# EAGLE design logoi (EAGLE 9.0.0)
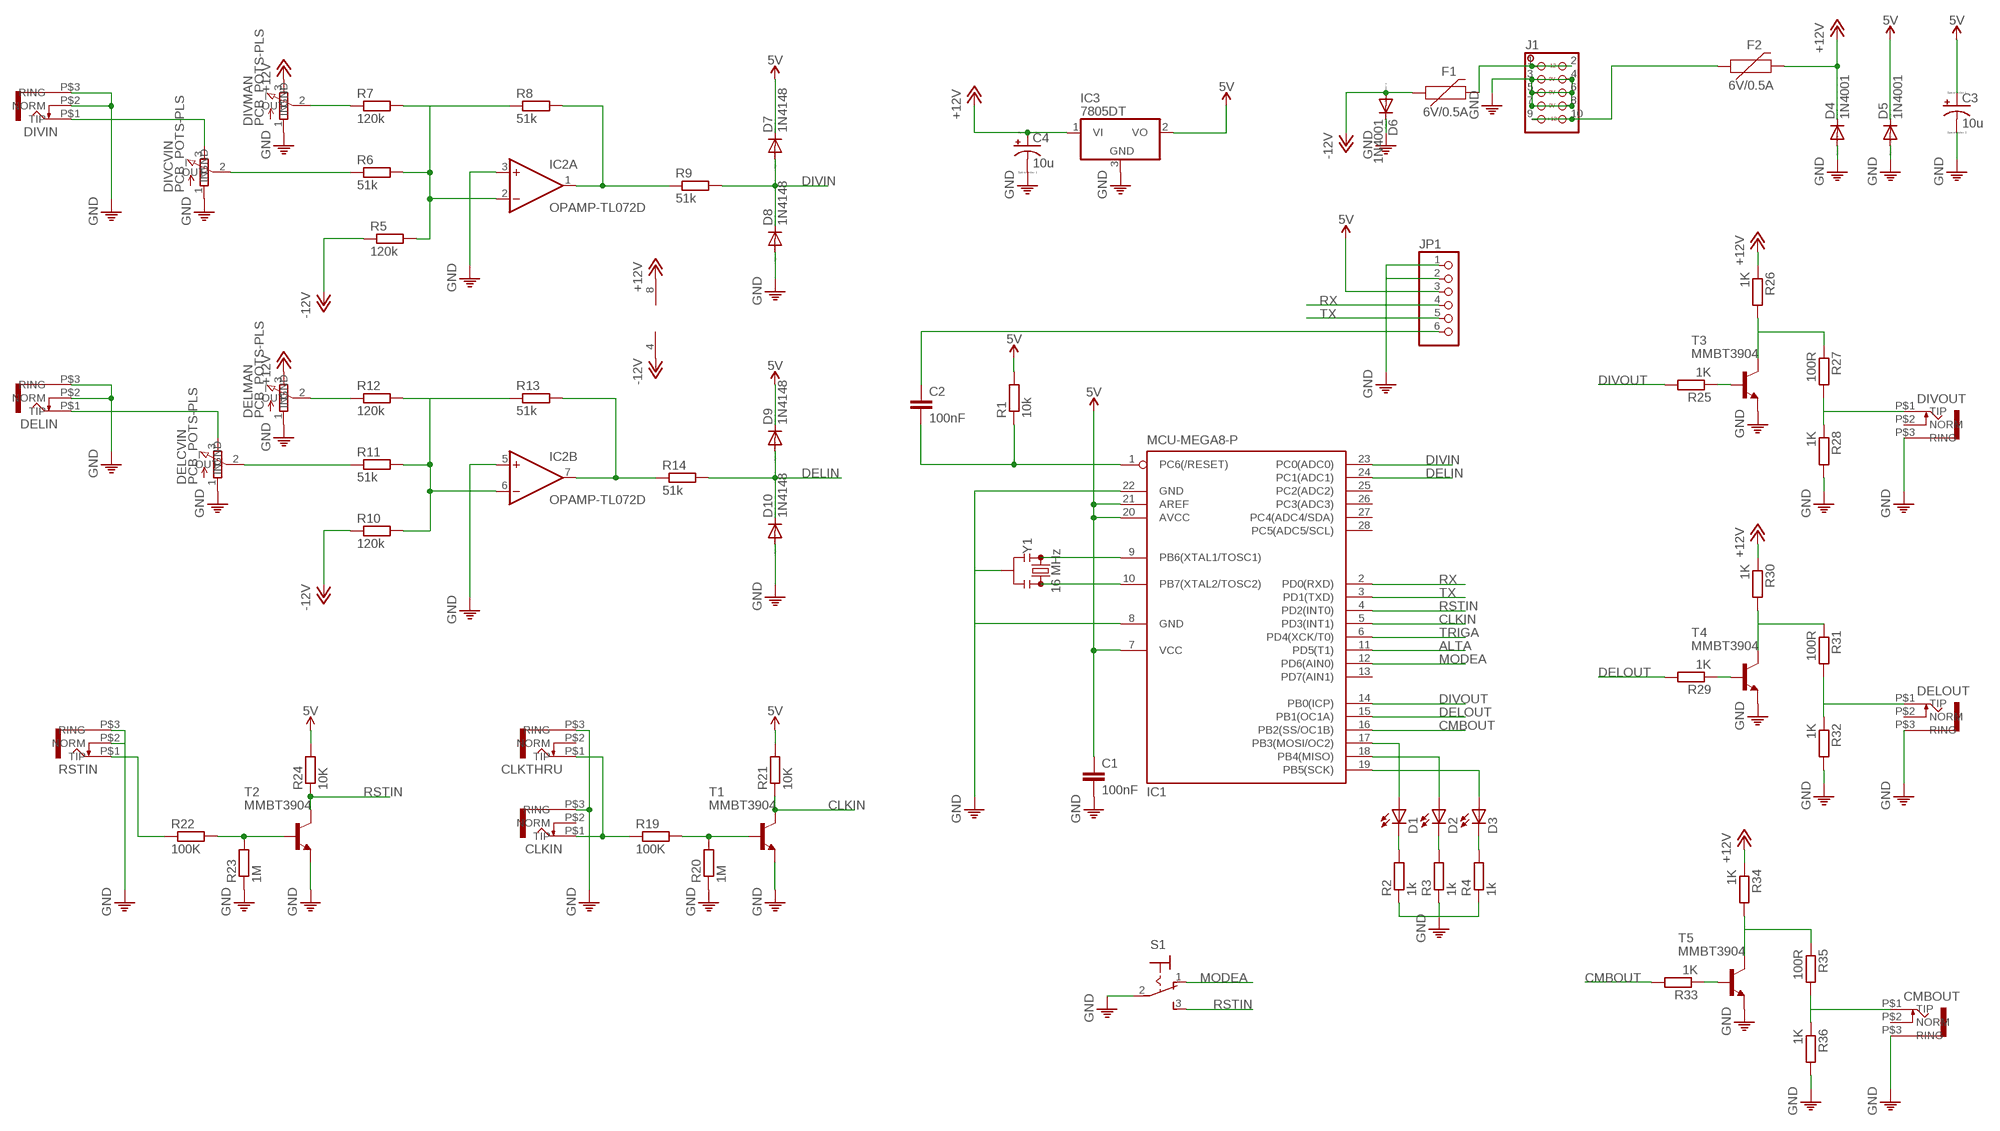
[diagram p0: schematic, sheet 1]

## Parts
C1  100nF  CAPACITOR-EUC0603  [C0603]
C2  100nF  CAPACITOR-EUC0603  [C0603]
C3  10u  CAPACITOR_POLARIZED-USE2.5-5  [E2,5-5]
C4  10u  CAPACITOR_POLARIZED-USE2.5-5  [E2,5-5]
CLKIN  VERTICALJACKS  [KOBICONN_PJM301DM_JACK]
CLKTHRU  VERTICALJACKS  [KOBICONN_PJM301DM_JACK]
CMBOUT  VERTICALJACKS  [KOBICONN_PJM301DM_JACK]
D1  LED3MM  [LED3MM]
D2  LED3MM  [LED3MM]
D3  LED3MM  [LED3MM]
D4  1N4001  DIODE-DO-214AC  [DO-214AC]
D5  1N4001  DIODE-DO-214AC  [DO-214AC]
D6  1N4001  DIODE-DO-214AC  [DO-214AC]
D7  1N4148  DIODE-1N4148SOD-323  [SOD323W_INFINEON]
D8  1N4148  DIODE-1N4148SOD-323  [SOD323W_INFINEON]
D9  1N4148  DIODE-1N4148SOD-323  [SOD323W_INFINEON]
D10  1N4148  DIODE-1N4148SOD-323  [SOD323W_INFINEON]
DELCVIN  PCB_POTS-PLS  [9MM_PLS]
DELIN  VERTICALJACKS  [KOBICONN_PJM301DM_JACK]
DELMAN  PCB_POTS-PLS  [9MM_PLS]
DELOUT  VERTICALJACKS  [KOBICONN_PJM301DM_JACK]
DIVCVIN  PCB_POTS-PLS  [9MM_PLS]
DIVIN  VERTICALJACKS  [KOBICONN_PJM301DM_JACK]
DIVMAN  PCB_POTS-PLS  [9MM_PLS]
DIVOUT  VERTICALJACKS  [KOBICONN_PJM301DM_JACK]
F1  6V/0.5A  FUSE-PPTC_HALF-AMP  [1206]
F2  6V/0.5A  FUSE-PPTC_HALF-AMP  [1206]
IC1  MCU-MEGA8-P  [DIL28-3]
IC2  OPAMP-TL072D  [SO08]
IC3  7805DT  [TO252]
J1  HEADER-EUROPWR_2X05-OPEN  [2X05_EUROPWR_OPEN]
JP1  PINHD-1X6  [1X06]
R1  10k  RESISTOR-EU_R0603  [R0603]
R2  1k  RESISTOR-EU_R0603  [R0603]
R3  1k  RESISTOR-EU_R0603  [R0603]
R4  1k  RESISTOR-EU_R0603  [R0603]
R5  120k  RESISTOR-EU_R0603  [R0603]
R6  51k  RESISTOR-EU_R0603  [R0603]
R7  120k  RESISTOR-EU_R0603  [R0603]
R8  51k  RESISTOR-EU_R0603  [R0603]
R9  51k  RESISTOR-EU_R0603  [R0603]
R10  120k  RESISTOR-EU_R0603  [R0603]
R11  51k  RESISTOR-EU_R0603  [R0603]
R12  120k  RESISTOR-EU_R0603  [R0603]
R13  51k  RESISTOR-EU_R0603  [R0603]
R14  51k  RESISTOR-EU_R0603  [R0603]
R19  100K  RESISTOR-EU_R0603  [R0603]
R20  1M  RESISTOR-EU_R0603  [R0603]
R21  10K  RESISTOR-EU_R0603  [R0603]
R22  100K  RESISTOR-EU_R0603  [R0603]
R23  1M  RESISTOR-EU_R0603  [R0603]
R24  10K  RESISTOR-EU_R0603  [R0603]
R25  1K  RESISTOR-EU_R0603  [R0603]
R26  1K  RESISTOR-EU_R0603  [R0603]
R27  100R  RESISTOR-EU_R0603  [R0603]
R28  1K  RESISTOR-EU_R0603  [R0603]
R29  1K  RESISTOR-EU_R0603  [R0603]
R30  1K  RESISTOR-EU_R0603  [R0603]
R31  100R  RESISTOR-EU_R0603  [R0603]
R32  1K  RESISTOR-EU_R0603  [R0603]
R33  1K  RESISTOR-EU_R0603  [R0603]
R34  1K  RESISTOR-EU_R0603  [R0603]
R35  100R  RESISTOR-EU_R0603  [R0603]
R36  1K  RESISTOR-EU_R0603  [R0603]
RSTIN  VERTICALJACKS  [KOBICONN_PJM301DM_JACK]
S1  SWITCH-SPDT-320-916  [320-916]
T1  MMBT3904  TRANSISTOR-NPN-MMBT3904LT1SOT23-BEC  [SOT23-BEC]
T2  MMBT3904  TRANSISTOR-NPN-MMBT3904LT1SOT23-BEC  [SOT23-BEC]
T3  MMBT3904  TRANSISTOR-NPN-MMBT3904LT1SOT23-BEC  [SOT23-BEC]
T4  MMBT3904  TRANSISTOR-NPN-MMBT3904LT1SOT23-BEC  [SOT23-BEC]
T5  MMBT3904  TRANSISTOR-NPN-MMBT3904LT1SOT23-BEC  [SOT23-BEC]
Y1  16 MHz  RESONATORPTH-7.6X3.8  [RESONATOR-PTH-7.6X3.8]

## Nets
5V: C1.1 C3.+ D5.C D7.C D9.C IC1.7(VCC) IC1.20(AVCC) IC1.21(AREF) IC3.2(VO) JP1.3 R1.2 R21.2 R24.2
+12V: C4.+ D4.C DELMAN.3(IN) DIVMAN.3(IN) F2.2 IC2.8(P:V+) IC3.1(VI) R26.1 R30.1 R34.1
-12V: D6.A F1.1 IC2.4(P:V-) R5.1 R10.1
ALTA: IC1.11(PD5(T1))
CLKIN: IC1.5(PD3(INT1)) R21.1 T1.C
CMBOUT: IC1.16(PB2(SS/OC1B)) R33.2
DELIN: D9.A D10.C IC1.24(PC1(ADC1)) R14.2
DELOUT: IC1.15(PB1(OC1A)) R29.2
DIVIN: D7.A D8.C IC1.23(PC0(ADC0)) R9.2
DIVOUT: IC1.14(PB0(ICP)) R25.2
MODEA: IC1.12(PD6(AIN0)) S1.1(O)
N$1: IC1.9(PB6(XTAL1/TOSC1)) Y1.1
N$2: IC1.10(PB7(XTAL2/TOSC2)) Y1.3
N$3: F1.2 J1.1 J1.2
N$4: C2.2 IC1.1(PC6(/RESET)) R1.1
N$5: C2.1 JP1.6
N$7 [GND]: F2.1 J1.9 J1.10
N$9: IC2.2(A:-IN) R5.2 R6.2 R7.2 R8.1
N$10: IC2.1(A:OUT) R8.2 R9.1
N$12: R25.1 T3.B
N$13: IC2.6(B:-IN) R10.2 R11.2 R12.2 R13.1
N$14: R26.2 R27.1 T3.C
N$15: IC2.7(B:OUT) R13.2 R14.1
N$17: DIVOUT.P$1(TIP) R27.2 R28.1
N$18: DIVCVIN.3(IN) DIVIN.P$1(TIP)
N$19: DIVCVIN.2(OUT) R6.1
N$20: DIVMAN.2(OUT) R7.1
N$21: D1.K(C) R2.2
N$22: D2.K(C) R3.2
N$23: D3.K(C) R4.2
N$24: D1.A IC1.17(PB3(MOSI/OC2))
N$25: D2.A IC1.18(PB4(MISO))
N$26: D3.A IC1.19(PB5(SCK))
N$27: DELCVIN.2(OUT) R11.1
N$28: DELCVIN.3(IN) DELIN.P$1(TIP)
N$29: DELMAN.2(OUT) R12.1
N$30: CLKIN.P$1(TIP) CLKTHRU.P$1(TIP) R19.1
N$31: R19.2 R20.2 T1.B
N$33: R22.1 RSTIN.P$1(TIP)
N$34: R22.2 R23.2 T2.B
N$35: R29.1 T4.B
N$36: R30.2 R31.1 T4.C
N$37: DELOUT.P$1(TIP) R31.2 R32.1
N$39: R33.1 T5.B
N$40: R34.2 R35.1 T5.C
N$41: CMBOUT.P$1(TIP) R35.2 R36.1
PE [GND]: C1.2 C3.- C4.- CLKIN.P$3(RING) CLKTHRU.P$3(RING) CMBOUT.P$3(RING) D4.A D5.A D6.C D8.A D10.A DELCVIN.1(GND) DELIN.P$2(NORM) DELIN.P$3(RING) DELMAN.1(GND) DELOUT.P$3(RING) DIVCVIN.1(GND) DIVIN.P$2(NORM) DIVIN.P$3(RING) DIVMAN.1(GND) DIVOUT.P$3(RING) IC1.8(GND) IC1.22(GND) IC2.3(A:+IN) IC2.5(B:+IN) IC3.3(GND) J1.3 J1.4 J1.5 J1.6 J1.7 J1.8 JP1.1 JP1.2 R2.1 R3.1 R4.1 R20.1 R23.1 R28.2 R32.2 R36.2 RSTIN.P$2(NORM) RSTIN.P$3(RING) S1.2(P) T1.E T2.E T3.E T4.E T5.E Y1.2 ; supply symbol labelled GND
RSTIN: IC1.4(PD2(INT0)) R24.1 S1.3(S) T2.C
RX: IC1.2(PD0(RXD)) JP1.4
TRIGA: IC1.6(PD4(XCK/T0))
TX: IC1.3(PD1(TXD)) JP1.5
Unconnected: CLKIN.P$2(NORM) CLKTHRU.P$2(NORM) CMBOUT.P$2(NORM) DELOUT.P$2(NORM) DIVOUT.P$2(NORM) IC1.13(PD7(AIN1)) IC1.25(PC2(ADC2)) IC1.26(PC3(ADC3)) IC1.27(PC4(ADC4/SDA)) IC1.28(PC5(ADC5/SCL))

## Library data of the parts
C1 C2 = 0000-master:CAPACITOR-EU: CAPACITOR, European symbol
C3 C4 = 0000-master:CAPACITOR_POLARIZED-US: POLARIZED CAPACITOR, American symbol
CLKIN CLKTHRU CMBOUT DELIN DELOUT DIVIN DIVOUT RSTIN = 0000-master:VERTICALJACKS
D1-D3 = 0000-master:LED: LED OSRAM: - CHIPLED LG R971, LG N971, LY N971, LG Q971, LY Q971, LO R971, LY R971 LH N974, LH R974 LS Q976, LO Q976, LY Q976 LO Q996 - Hyper CHIPLED LW Q18S LB Q993, LB Q99A, LB R99A - SideLED LS A670, LO A670, LY A670, LG A670, LP A670 LB A673, LV A673, LT A673, LW A673 LH A674 LY A675 LS A676, LA A676, LO A676, LY A676, LW A676 LS A679, LY A679, LG A679 - Hyper Micro SIDELED® LS Y876, LA Y876, LO Y876, LY Y876 LT Y87S - SmartLED LW L88C, LW L88S LB L89C, LB L89S, LG L890 LS L89K, LO L89K, LY L89K LS L896, LA L896, LO L896, LY L896 - TOPLED LS T670, LO T670, LY T670, LG T670, LP T670 LSG T670, LSP T670, LSY T670, LOP T670, LYG T670 LG T671, LOG T671, LSG T671 LB T673, LV T673, LT T673, LW T673 LH T674 LS T676, LA T676, LO T676, LY T676, LB T676, LH T676, LSB T676, LW T676 LB T67C, LV T67C, LT T67C, LS T67K, LO T67K, LY T67K, LW E67C LS E67B, LA E67B, LO E67B, LY E67B, LB E67C, LV E67C, LT E67C LW T67C LS T679, LY T679, LG T679 LS T770, LO T770, LY T770, LG T770, LP T770 LB T773, LV T773, LT T773, LW T773 LH T774 LS E675, LA E675, LY E675, LS T675 LS T776, LA T776, LO T776, LY T776, LB T776 LHGB T686 LT T68C, LB T68C - Hyper Mini TOPLED® LB M676 - Mini TOPLED Santana® LG M470 LS M47K, LO M47K, LY M47K Source: http://www.osram.convergy.de LUXEON: - LUMILED® LXK2-PW12-R00, LXK2-PW12-S00, LXK2-PW14-U00, LXK2-PW14-V00 LXK2-PM12-R00, LXK2-PM12-S00, LXK2-PM14-U00 LXK2-PE12-Q00, LXK2-PE12-R00, LXK2-PE12-S00, LXK2-PE14-T00, LXK2-PE14-U00 LXK2-PB12-K00, LXK2-PB12-L00, LXK2-PB12-M00, LXK2-PB14-N00, LXK2-PB14-P00, LXK2-PB14-Q00 LXK2-PR12-L00, LXK2-PR12-M00, LXK2-PR14-Q00, LXK2-PR14-R00 LXK2-PD12-Q00, LXK2-PD12-R00, LXK2-PD12-S00 LXK2-PH12-R00, LXK2-PH12-S00 LXK2-PL12-P00, LXK2-PL12-Q00, LXK2-PL12-R00 Source: www.luxeon.com KINGBRIGHT: KA-3528ASYC Source: www.kingbright.com
D4-D6 = diode:DIODE-: DIODE
D7-D10 = 0000-master:DIODE-1N4148: DIODE high speed (Philips)
DELCVIN DELMAN DIVCVIN DIVMAN = 0000-master:PCB_POTS: 9 mm Square Rotary Potentiometers Source: Panasonic
F1 F2 = 0000-master:FUSE-PPTC: Resettable Fuse PPTC Resettable Fuse. Really a sort of resistor with a polymeric positive temperature coefficient whose resistance increases dramatically with an increase in temperature. When heated by the power passing through the resistance rises causing the current to be limited, protecting the circuit. This is achieved by the transition of the polymer from a crystalline to an amorphous state where the conductive carbon separates breaking the conductive pathways found in the cool crystalline structure. When a PPTC cools back down it resumes conducting letting the circuit turn back on. SparkFun Products: SparkFun RedBoard - Programmed with Arduino <https://www.sparkfun.com/products/12757> Pro Micro - 5V/16MHz <https://www.sparkfun.com/products/12640> Arduino Pro 328 - 5V/16MHz <https://www.sparkfun.com/products/10915> MP3 Trigger <https://www.sparkfun.com/products/13720>; PROD_ID: RES-08585
IC1 = 0000-master:MCU-MEGA8-P: MICROCONTROLLER 8 Kbytes FLASH, 1 kbytes SRAM, 512 bytes EEPROM, USART, 4-channel 10 bit ADC, 2-channel 8 bit ADC Pin compatible with Atmega48, ATMega88, ATMega168 Source: avr.lbr; OC_FARNELL: unknown; OC_NEWARK: unknown
IC2 = 0000-master:OPAMP-TL072: OP AMP
IC3 = linear:78*: Positive VOLTAGE REGULATOR Source: http://cache.national.com/ds/LM/LM78L05.pdf http://www.fairchildsemi.com/ds/LM/LM7805.pdf
J1 = 0000-master:HEADER-EUROPWR_2X05: 2x05 pin header
JP1 = pinhead:PINHD-1X6: PIN HEADER
R1-R14 R19-R36 = 0000-master:RESISTOR-EU_: RESISTOR, European symbol
S1 = 0000-master:SWITCH-SPDT-320-916: TOGGLE SWITCH distributor RS Components
T1-T5 = 0000-master:TRANSISTOR-NPN-: NPN Transistror BF959 corrected 2008.03.06
Y1 = 0000-master:RESONATOR: Resonators (Generic) Ceramic resonators are clock-generating components, often used to control timing in microcontrollers. They usually have 3 pins: two pins for oscillation, and one pin for ground. Compared to crystals, resonators have worse tolerance, but are usually much cheaper. Plus, they have built-in load capacitors! These devices are used on boards like the Arduino Pro 8MHz <https://www.sparkfun.com/products/11114> and Arduino Pro 16MHz <https://www.sparkfun.com/products/11113>.

## Net classes
0 default: width 0.203 mm
1 GND: width 0.305 mm

## Board
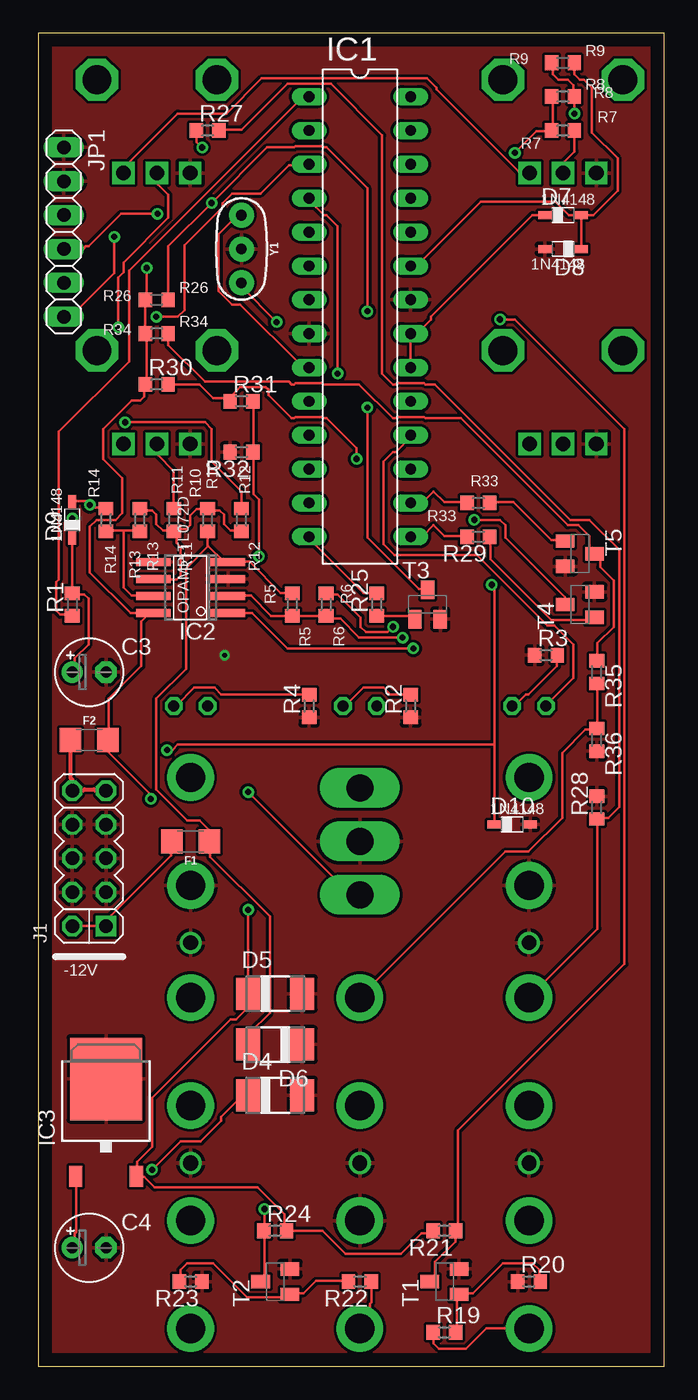
[diagram p1: board, top side]
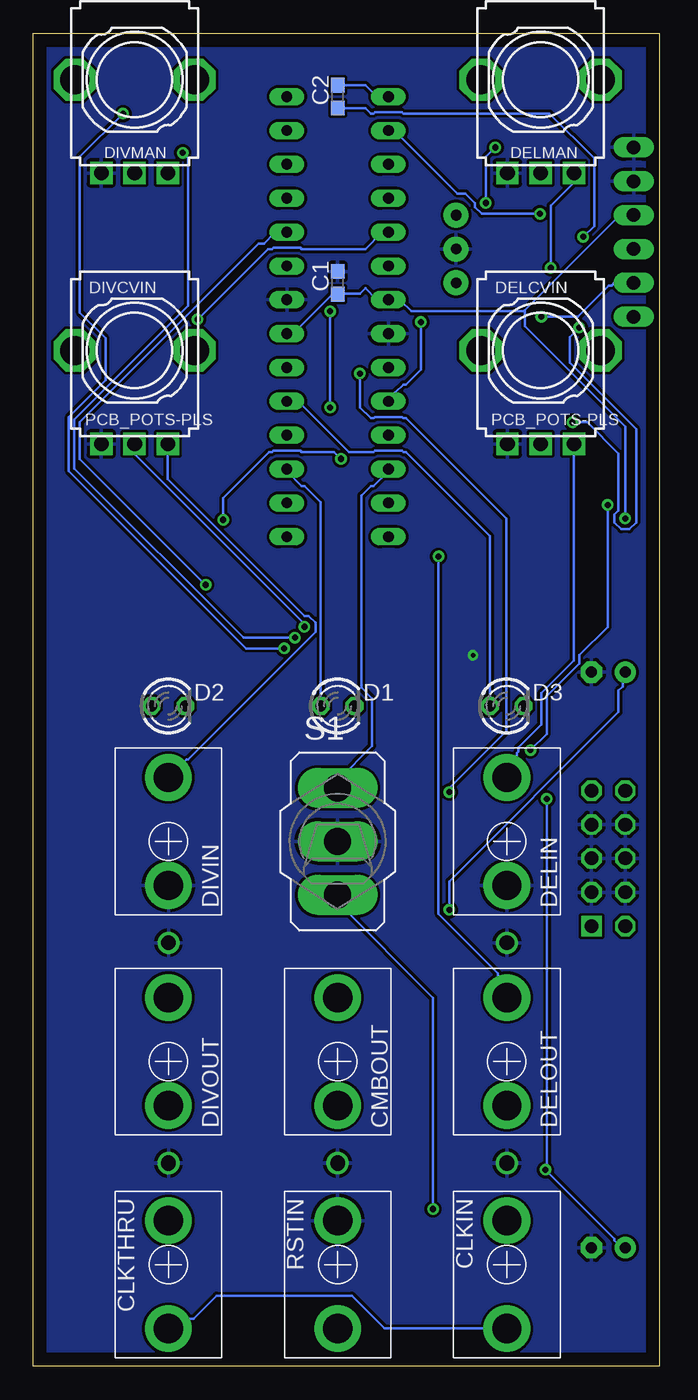
[diagram p2: board, bottom side, seen from below]

Size 46.97 x 100 mm. Coordinates in mm from the lower left corner, seen from the top.
Outline: 0,0 46.97,0 46.97,100 0,100 0,0
Copper layers (1*16): Top 0.035mm / dielectric 1.5mm / Bottom 0.035mm
Design rules "default *": minimum track width 8mil, minimum drill 18mil, track to track 8mil, track to pad 8mil, pad to pad 8mil, via to via 8mil, smd to smd 8mil, copper to edge 40mil, drill to drill 8mil, minimum pad ring 10mil, minimum via ring 8mil, stop-mask expansion 4mil, vias tented up to drill 0mil, thermal gap 10mil

### Footprints (pad centres in the part's own frame; a part is rotated, then mirrored left to right if it is on the bottom)
C0603 = smd 1.1 x 1: 1 -0.85,0; 2 0.85,0
E2,5-5 = drill 0.813 pad 1.6: + -1.27,0 | drill 0.813 pad 1.6 octagon: - 1.27,0
KOBICONN_PJM301DM_JACK = drill 2.2 pad 3.5: P$1 0,4.8; P$2 0,-3.3 | drill 1.1: P$3 0,-7.6
LED3MM = drill 0.813 octagon: A -1.27,0; K 1.27,0
DO-214AC = smd 1.8 x 2.4: A 2.025,0; C -2.025,0
SOD323W_INFINEON = smd 1 x 0.6: A 1.35,0; C -1.35,0
9MM_PLS = drill 1.1 pad 1.676 square: 1 -2.5,-7; 2 0,-7; 3 2.5,-7 | drill 2.159 pad 3.175 octagon: M1 4.5,0; M2 -4.5,0
1206 = smd 1.6 x 1.8: 1 -1.4,0; 2 1.4,0
DIL28-3 = drill 0.813 long: 1 -16.51,-3.81; 2 -13.97,-3.81; 3 -11.43,-3.81; 4 -8.89,-3.81; 5 -6.35,-3.81; 6 -3.81,-3.81; 7 -1.27,-3.81; 8 1.27,-3.81; 9 3.81,-3.81; 10 6.35,-3.81; 11 8.89,-3.81; 12 11.43,-3.81; 13 13.97,-3.81; 14 16.51,-3.81; 15 16.51,3.81; 16 13.97,3.81; 17 11.43,3.81; 18 8.89,3.81; 19 6.35,3.81; 20 3.81,3.81; 21 1.27,3.81; 22 -1.27,3.81; 23 -3.81,3.81; 24 -6.35,3.81; 25 -8.89,3.81; 26 -11.43,3.81; 27 -13.97,3.81; 28 -16.51,3.81
SO08 = smd 0.6 x 2.6: 1 -1.905,-2.8; 2 -0.635,-2.8; 3 0.635,-2.8; 4 1.905,-2.8; 5 1.905,2.8; 6 0.635,2.8; 7 -0.635,2.8; 8 -1.905,2.8
TO252 = smd 1 x 1.6: 1 -2.28,-4.8; 2 2.28,-4.8 | smd 5.4 x 6.2: 3 0,2.5
2X05_EUROPWR_OPEN = drill 1.016 square: 1 -5.08,-1.27 | drill 1.016 octagon: 2 -5.08,1.27; 3 -2.54,-1.27; 4 -2.54,1.27; 5 0,-1.27; 6 0,1.27; 7 2.54,-1.27; 8 2.54,1.27; 9 5.08,-1.27; 10 5.08,1.27
1X06 = drill 1.016 long: 1 -6.35,0; 2 -3.81,0; 3 -1.27,0; 4 1.27,0; 5 3.81,0; 6 6.35,0
R0603 = smd 1 x 1.1: 1 -0.85,0; 2 0.85,0
320-916 = drill 2.007 long: 1 0,4.013; 2 0,0; 3 0,-4.013
SOT23-BEC = smd 1 x 1.4: B -0.95,-1.1; C 0,1.1; E 0.95,-1.1
RESONATOR-PTH-7.6X3.8 = drill 0.8 pad 1.88: 1 -2.54,0; 2 0,0; 3 2.54,0

### Placement (x,y rotation side)
C1  24.13,81.28 90 bottom
C2  24.13,95.25 90 bottom
C3  3.81,52.07 0 top
C4  3.81,8.89 0 top
CLKIN  11.43,7.62 180 bottom
CLKTHRU  36.83,7.62 180 bottom
CMBOUT  24.13,22.86 0 bottom
D1  24.13,49.53 0 bottom
D2  36.83,49.53 0 bottom
D3  11.43,49.53 0 bottom
D4  17.78,20.32 0 top
D5  17.78,27.94 0 top
D6  17.78,24.13 180 top
D7  39.37,86.36 0 top
D8  39.37,83.82 180 top
D9  2.54,63.5 90 top
D10  35.56,40.64 0 top
DELCVIN  8.89,76.2 0 bottom
DELIN  11.43,39.37 0 bottom
DELMAN  8.89,96.52 0 bottom
DELOUT  11.43,22.86 0 bottom
DIVCVIN  39.37,76.2 0 bottom
DIVIN  36.83,39.37 0 bottom
DIVMAN  39.37,96.52 0 bottom
DIVOUT  36.83,22.86 0 bottom
F1  11.43,39.37 180 top
F2  3.81,46.99 0 top
IC1  24.13,78.74 270 top
IC2  11.43,58.42 90 top
IC3  5.08,19.05 0 top
J1  3.81,38.1 90 top
JP1  1.91,85.09 270 top
R1  2.54,57.15 90 top
R2  27.94,49.53 90 top
R3  38.1,53.34 0 top
R4  20.32,49.53 90 top
R5  19.05,57.15 270 top
R6  21.59,57.15 270 top
R7  39.37,92.71 180 top
R8  39.37,95.25 0 top
R9  39.37,97.79 0 top
R10  12.7,63.5 90 top
R11  10.16,63.5 270 top
R12  15.24,63.5 270 top
R13  7.62,63.5 270 top
R14  5.08,63.5 90 top
R19  30.48,2.54 0 top
R20  36.83,6.35 0 top
R21  30.48,10.16 180 top
R22  24.13,6.35 180 top
R23  11.43,6.35 180 top
R24  17.78,10.16 0 top
R25  25.4,57.15 90 top
R26  8.89,80.01 0 top
R27  12.7,92.71 0 top
R28  41.91,41.91 90 top
R29  33.02,62.23 180 top
R30  8.89,73.66 0 top
R31  15.24,72.39 0 top
R32  15.24,68.58 180 top
R33  33.02,64.77 180 top
R34  8.89,77.47 0 top
R35  41.91,52.07 270 top
R36  41.91,46.99 270 top
RSTIN  24.13,7.62 180 bottom
S1  24.13,39.37 0 bottom
T1  30.48,6.35 90 top
T2  17.78,6.35 90 top
T3  29.21,57.15 0 top
T4  40.64,57.15 90 top
T5  40.64,60.96 270 top
Y1  15.24,83.82 270 top

### Tracks (layer width: path | path; a pad name or v marks a point on that pad's centre or on a via)
5V  (via drill 0.46)
  Top 0.203: R21.2 29.57,10.16 29.36,9.96 28.75,9.96 27.23,8.43 23.06,8.43 21.34,10.16 R24.2 18.59,10.16 18.49,10.26 18.49,11.38 16.46,13.41 8.74,13.41 7.92,14.22 7.42,14.22 IC3.2 7.42,14.33 7.42,15.34 8.53,16.46 8.53,20.12 14.43,26.01 14.83,26.01 15.75,26.92 15.75,27.94 | D7.C 37.08,86.36 29.46,78.74 29.46,78.54 28.45,77.52 27.94,77.52 IC1.21 IC1.20 | C3.+ 2.54,52.12 2.74,52.32 2.74,53.14 3.76,54.15 3.76,57.61 3.45,57.91 2.54,57.91 R1.2 D9.C v2.54,63.6 | v15.75,34.24 15.75,27.94 | 15.75,27.94 D5.C
  Bottom 0.203: JP1.3 2.95,86.36 10.11,79.2 | 10.11,79.2 10.16,79.15 18.59,79.15 19.41,79.96 20.32,79.96 IC1.7 20.32,80.06 21.23,80.06 22.05,80.87 22.45,80.47 24.08,80.47 C1.1 24.18,80.37 24.59,80.37 27.43,77.52 27.94,77.52 IC1.21 | v2.54,63.6 2.54,70.51 10.06,78.03 10.06,79.15 10.11,79.2 | v15.75,34.24 15.75,36.37 3.05,49.07 3.05,50.7 2.74,51 2.74,51.82 2.54,52.02 C3.+
+12V  (via drill 0.46)
  Top 0.203: IC3.1 2.85,14.22 2.85,10.06 2.74,9.96 2.74,9.14 2.54,8.94 C4.+ | D4.C 15.34,20.32 13.72,18.69 13.72,18.39 12.19,16.87 10.67,16.87 v8.53,14.73 | v8.13,82.4 8.13,80.06 R26.1 8.03,79.96 8.03,77.52 R34.1 8.13,77.42 8.13,73.66 R30.1 8.03,73.66 7.92,73.56 7.92,72.75 7.62,72.44 7.01,72.44 4.88,70.31 4.88,68.07 6.3,66.65 6.3,64.01 5.79,63.5 4.37,63.5 3.86,62.99 3.86,59.54 6.91,56.49 7.82,56.49 8.03,56.29 IC2.8 8.53,56.49 8.33,56.49 7.72,55.88 7.72,52.53 5.28,50.09 5.28,47.04 F2.2 5.18,46.94 5.18,46.13 8.43,42.88 v8.43,42.57 | DIVMAN.3 36.78,89.61 36.07,89.61 29.87,95.81 29.87,95.91 29.16,96.62 16.76,96.62 14.12,93.98 10.46,93.98 6.4,89.92 6.4,89.61 DELMAN.3
  Bottom 0.203: C4.+ 2.54,8.94 2.85,8.94 3.35,9.45 3.35,9.55 v8.53,14.73 8.43,14.73 v8.43,42.57 | v8.13,82.4 8.13,87.07 6.4,88.8 DELMAN.3
-12V
  Top 0.203: R5.1 19,58.01 18.19,58.01 15.85,60.35 14.33,60.35 IC2.4 14.22,60.35 13.92,60.35 12.75,61.52 | R10.1 12.7,61.57 12.75,61.52 | D6.A 15.85,24.18 15.85,24.99 17.37,26.52 17.37,33.73 12.9,38.2 12.9,39.32 F1.1 12.8,39.42 12.8,40.23 12.09,40.95 11.18,40.95 8.84,43.28 8.84,50.09 11.07,52.32 11.07,59.84 12.75,61.52
CLKIN  (via drill 0.46)
  Top 0.203: T1.C 29.46,6.4 29.77,6.71 29.77,7.82 31.29,9.35 31.29,10.16 R21.1 31.39,10.16 31.5,10.26 31.5,17.68 43.99,30.18 43.99,70.31 35.76,78.54 v34.65,78.54
  Bottom 0.203: v34.65,78.54 29.36,83.82 29.06,83.82 28.96,83.92 26.92,83.92 26.82,83.82 22.05,83.82 20.83,85.04 20.32,85.04 IC1.5
CMBOUT
  Top 0.203: R33.2 32.11,64.82 30.48,64.82 29.67,65.63 28.85,64.82 27.94,64.82 IC1.16
DELIN  (via drill 0.46)
  Top 0.203: 3.91,64.67 4.17,64.41 5.08,64.41 R14.2 | 3.91,64.67 3.66,64.92 2.54,64.92 D9.A | 34.24,46.63 34.24,58.42 v34.04,58.62 | 34.24,46.63 34.24,40.64 D10.C | v9.65,46.23 10.06,46.23 10.46,46.63 34.24,46.63 | v3.86,64.62 3.91,64.67
  Bottom 0.203: v34.04,58.62 43.48,68.07 43.48,70.81 30.07,84.23 29.67,84.23 28.85,85.04 27.94,85.04 IC1.24 | v3.86,64.62 3.86,55.47 5.99,53.34 5.99,52.73 8.43,50.29 8.43,47.45 v9.65,46.23
DELOUT
  Top 0.203: R29.2 32.11,62.28 30.48,62.28 29.67,63.09 28.85,62.28 27.94,62.28 IC1.15
DIVIN
  Top 0.203: 40.74,86.36 40.74,83.82 D8.C | 40.74,86.36 41.66,86.36 43.48,88.19 43.48,90.63 41.55,92.56 41.55,95.91 40.95,96.52 40.64,96.52 40.23,96.93 40.23,97.74 R9.2 | 40.74,86.36 D7.A 39.83,86.36 38.81,87.38 33.22,87.38 28.45,82.6 27.94,82.6 IC1.23
DIVOUT
  Top 0.203: IC1.14 20.32,62.08 24.38,58.01 25.4,58.01 R25.2
MODEA
  Bottom 0.203: IC1.12 20.32,67.26 20.83,66.75 20.83,66.65 21.44,66.04 21.64,66.04 22.35,65.33 22.35,50.9 21.54,50.09 21.54,46.53 24.08,43.99 24.08,43.38 S1.1
N$1
  Top 0.203: Y1.1 14.94,86.36 13.51,84.94 13.51,80.67 14.53,79.65 15.14,79.65 19.81,74.98 20.32,74.98 IC1.9
N$2  (via drill 0.46)
  Top 0.203: v17.88,78.33 15.24,80.97 Y1.3
  Bottom 0.203: v17.88,78.33 17.88,74.78 19,73.66 19.2,73.66 19.81,73.05 19.81,72.95 20.32,72.44 IC1.10
N$3
  Top 0.203: F1.2 9.96,39.32 9.96,38.3 5.08,33.43 J1.1 J1.2
N$4
  Top 0.203: R1.1 2.54,56.39 1.63,56.39 1.32,56.69 1.32,58.83 1.52,59.03 1.52,70.1 6.81,75.39 6.81,82.19 19.81,95.2 20.32,95.2 IC1.1
  Bottom 0.203: C2.2 24.08,96.11 22.05,96.11 21.23,95.3 20.32,95.3 IC1.1
N$5  (via drill 0.46)
  Top 0.203: v5.69,84.73 5.69,81.99 2.44,78.74 JP1.6
  Bottom 0.203: v5.69,84.73 4.88,85.55 4.88,90.63 8.23,93.98 19.2,93.98 19.3,94.08 21.34,94.08 21.44,93.98 21.64,93.98 22.05,94.39 24.08,94.39 C2.1
N$7
  Top 0.305: F2.1 2.44,46.94 2.44,44.09 2.54,43.99 J1.10 3.35,43.18 3.45,43.28 4.17,43.28 4.27,43.18 J1.9
N$9  (via drill 0.46)
  Top 0.203: R8.1 38.61,95.2 38.61,92.76 R7.2 38.51,92.66 37.39,92.66 v35.76,91.03 | IC2.2 14.33,57.81 15.95,57.81 17.48,56.29 19,56.29 R5.2 19.1,56.29 21.54,56.29 R6.2 21.64,56.29 21.84,56.08 22.66,56.08 24.08,54.66 v27.33,54.66
  Bottom 0.203: v35.76,91.03 35.36,90.63 35.36,79.55 43.89,71.02 43.89,67.36 31.19,54.66 v27.33,54.66
N$10  (via drill 0.46)
  Top 0.203: R9.1 38.61,97.74 38.61,96.93 39.01,96.52 39.73,96.52 40.13,96.11 40.13,95.3 R8.2 40.23,95.2 v40.23,93.98 | v28.14,53.85 18.69,53.85 16.05,56.49 14.33,56.49 IC2.1
  Bottom 0.203: v40.23,93.98 43.48,90.73 43.48,79.05 41.55,77.11 41.55,73.97 44.3,71.22 44.3,67.16 30.99,53.85 v28.14,53.85
N$12
  Top 0.203: R25.1 25.4,56.29 28.04,56.29 28.25,56.08 T3.B
N$13
  Top 0.203: 10.16,62.69 9.35,62.69 8.84,63.2 8.84,63.91 8.53,64.21 7.72,64.21 7.62,64.31 R13.1 | 12.7,64.31 11.89,64.31 11.38,63.8 11.38,63.09 11.07,62.79 10.26,62.79 10.16,62.69 | 10.16,62.69 R11.2 10.16,62.59 10.36,62.38 10.36,61.77 10.67,61.47 10.67,59.33 10.36,59.03 8.64,59.03 IC2.6 | 12.7,64.31 12.8,64.21 13.61,64.21 13.92,63.91 13.92,63.2 14.43,62.69 15.24,62.69 R12.2 | 12.7,64.31 R10.2
N$14  (via drill 0.46)
  Top 0.203: v12.29,91.44 11.89,91.85 11.89,92.66 R27.1 | R26.2 9.75,80.06 9.75,84.02 v13.01,87.27 17.17,91.44 19.2,91.44 19.3,91.54 21.34,91.54 21.44,91.44 21.64,91.44 24.69,88.39 v24.69,79.15 | v24.69,71.93 24.69,62.18 28.55,58.32 29.16,58.32 T3.C
  Bottom 0.203: v13.01,87.27 13.01,90.73 v12.29,91.44 | v24.69,79.15 v24.69,71.93
N$15
  Top 0.203: 6.4,62.69 7.62,62.69 R13.2 | 6.4,62.69 5.08,62.69 R14.1 | 6.4,62.69 6.4,58.42 7.01,57.81 8.53,57.81 IC2.7
N$17
  Top 0.203: DIVOUT.P$1 36.88,27.74 41.96,32.82 41.96,41.05 R28.1 41.96,41.15 42.77,41.15 43.59,41.96 43.59,61.27 41.35,63.5 39.93,63.5 29.77,73.66 29.06,73.66 28.96,73.76 26.92,73.76 26.82,73.66 26.62,73.66 25.81,74.47 25.81,92.35 21.95,96.22 18.69,96.22 15.24,92.76 13.61,92.76 R27.2
N$18
  Bottom 0.203: DIVCVIN.3 36.88,69.19 36.88,66.55 26.62,56.29 26.31,56.29 25.81,55.78 25.81,55.07 35.36,45.52 35.46,45.52 36.78,44.2 DIVIN.P$1
N$19  (via drill 0.46)
  Top 0.203: v26.62,55.47 26.21,55.07 24.59,55.07 24.18,55.47 24.18,56.19 22.45,57.91 21.64,57.91 R6.1
  Bottom 0.203: v26.62,55.47 26.62,55.68 39.32,68.38 39.32,69.19 DIVCVIN.2
N$20
  Top 0.203: R7.1 40.23,92.66 40.23,91.14 39.42,90.32 39.42,89.61 DIVMAN.2
N$21
  Top 0.203: R2.2 27.94,50.39 26.42,50.39 25.91,50.9 24.38,50.9 23.06,49.58 22.86,49.58 D1.K
N$22
  Top 0.203: R3.2 38.91,53.34 38.91,52.53 36.78,50.39 36.58,50.39 35.76,49.58 35.56,49.58 D2.K
N$23
  Top 0.203: R4.2 20.32,50.39 13.72,50.39 13.21,50.9 11.68,50.9 10.36,49.58 10.16,49.58 D3.K
N$24
  Bottom 0.203: D1.A 25.4,64.82 26.62,66.04 26.82,66.04 27.94,67.16 IC1.17
N$25
  Top 0.203: IC1.18 27.94,69.7 26.82,68.58 26.62,68.58 25.91,67.87 25.91,61.67 26.72,60.86 32.92,60.86 38.2,55.58 38.71,55.58 40.13,54.15 40.13,51.61 38.1,49.58 D2.A
N$26
  Bottom 0.203: D3.A 12.7,62.28 19,68.58 19.2,68.58 19.3,68.68 21.34,68.68 21.44,68.58 23.27,68.58 27.03,72.34 27.94,72.34 IC1.19
N$27
  Top 0.203: R11.1 10.16,67.16 8.94,68.38 8.94,69.19 DELCVIN.2
N$28
  Bottom 0.203: DELCVIN.3 6.4,52.93 8.84,50.49 8.84,48.16 10.57,46.43 10.57,46.13 10.67,46.02 10.67,44.91 11.38,44.2 DELIN.P$1
N$29  (via drill 0.46)
  Top 0.203: R12.1 15.24,65.63 13.01,67.87 13.01,70.31 12.5,70.81 v6.5,70.81 | v5.99,77.93 5.99,81.69 6.4,82.09 6.4,82.8 9.75,86.16 9.75,87.88 8.94,88.7 8.94,89.51 DELMAN.2
  Bottom 0.203: v6.5,70.81 5.38,70.81 3.05,68.48 3.05,64.21 3.35,63.91 3.35,63.3 2.85,62.79 2.23,62.79 1.73,63.3 1.73,70.31 6.71,75.29 6.71,77.22 v5.99,77.93
N$30
  Top 0.203: R19.1 29.67,2.54 29.67,1.73 30.07,1.32 32.11,1.32 33.63,2.85 36.78,2.85 CLKTHRU.P$1
  Bottom 0.203: CLKIN.P$1 11.48,2.85 20.62,2.85 23.06,5.28 33.22,5.28 34.95,3.56 36.07,3.56 36.78,2.85 CLKTHRU.P$1
N$31
  Top 0.203: R19.2 31.39,2.54 31.39,5.28 31.5,5.38 T1.B 31.6,5.49 32.61,5.49 34.85,7.72 37.08,7.72 37.59,7.21 37.59,6.4 R20.2
N$33
  Top 0.203: R22.1 24.99,6.3 24.99,4.78 24.89,4.67 24.89,3.56 24.18,2.85 RSTIN.P$1
N$34
  Top 0.203: R23.2 10.67,6.4 10.67,7.21 11.18,7.72 13.11,7.72 15.65,5.18 18.59,5.18 18.8,5.38 T2.B 18.9,5.49 19.91,5.49 20.83,6.4 23.27,6.4 R22.2
N$35
  Top 0.203: R29.1 33.93,62.18 33.93,60.55 38.51,55.98 41.45,55.98 41.66,56.19 T4.B
N$36  (via drill 0.46)
  Top 0.203: R30.2 12.09,73.66 13.11,72.64 14.12,72.64 14.22,72.54 | 14.22,72.54 14.33,72.44 R31.1 14.22,72.54 | v32.72,63.5 34.65,63.5 35.05,63.09 35.05,62.18 39.52,57.71 39.52,57.2 T4.C | v23.88,68.07 23.88,68.89 21.64,71.12 21.44,71.12 21.34,71.22 19.3,71.22 19.2,71.12 19,71.12 17.27,72.85 17.27,73.25 17.07,73.46 15.14,73.46 14.22,72.54
  Bottom 0.203: v32.72,63.5 32.72,65.13 29.26,68.58 29.06,68.58 28.96,68.68 26.92,68.68 26.82,68.58 24.38,68.58 v23.88,68.07
N$37  (via drill 0.46)
  Top 0.203: 16.15,68.58 16.15,72.34 R31.2 | 16.15,68.58 16.15,65.43 16.56,65.02 v16.56,60.76 | 16.15,68.58 R32.1
  Bottom 0.203: v16.56,60.76 16.56,33.93 12.09,29.46 12.09,28.35 11.48,27.74 DELOUT.P$1
N$39
  Top 0.203: R33.1 33.93,64.82 35.66,64.82 38.51,61.98 39.52,61.98 T5.B
N$40
  Top 0.203: R34.2 9.75,77.42 9.75,76.61 12.5,73.86 18.8,73.86 19,73.66 19.2,73.66 19.3,73.76 21.34,73.76 21.44,73.66 24.08,73.66 26.62,71.12 26.82,71.12 26.92,71.22 28.96,71.22 29.06,71.12 31.7,71.12 39.73,63.09 40.54,63.09 41.35,62.28 41.35,61.27 41.66,60.96 T5.C 41.76,60.96 42.16,60.55 42.16,59.94 43.18,58.93 43.18,55.47 41.96,54.25 41.96,52.93 R35.1
N$41
  Top 0.203: R35.2 41.96,51.21 41.96,47.85 R36.1 41.86,47.75 41.05,47.75 39.32,46.02 39.32,41.15 36.78,38.61 35.05,38.61 24.18,27.74 CMBOUT.P$1
PE  (via drill 0.35)
  other vias: 13.97,53.34
  pour Top: 0,0 46.99,0 46.99,100.33 0,100.33
  pour Bottom: 0,100.33 46.99,100.33 46.99,0 0,0
RSTIN  (via drill 0.46)
  Top 0.203: 16.97,10.16 16.97,6.6 16.76,6.4 T2.C | v16.97,11.79 16.97,10.16 | 16.97,10.16 R24.1 | v22.45,74.47 22.45,85.55 21.64,86.36 21.44,86.36 20.83,86.97 20.83,87.07 20.32,87.58 IC1.4 | v15.75,43.08 23.47,35.36 S1.3
  Bottom 0.203: v16.97,11.79 16.97,27.64 24.08,34.75 24.08,35.36 S1.3 | v22.45,74.47 22.45,71.93 21.64,71.12 21.44,71.12 21.34,71.22 19.3,71.22 19.2,71.12 19,71.12 11.48,63.6 11.48,47.65 15.75,43.38 v15.75,43.08
RX  (via drill 0.46)
  Top 0.203: v8.94,86.46 6.2,86.46 3.76,84.02 3.56,84.02 3.35,83.82 JP1.4
  Bottom 0.203: v8.94,86.46 13.31,86.46 13.82,86.97 13.82,87.27 14.53,87.99 15.14,87.99 19.81,92.66 20.32,92.66 IC1.2
TX  (via drill 0.46)
  Top 0.203: v8.84,78.74 10.46,78.74 10.97,79.25 10.97,84.12 13.82,86.97 13.82,87.27 14.53,87.99 16.66,87.99 18.8,90.12 20.32,90.12 IC1.3
  Bottom 0.203: v8.84,78.74 6.1,78.74 3.76,81.08 3.56,81.08 3.35,81.28 JP1.5